# EAGLE design Eliz (EAGLE 9.0.0)
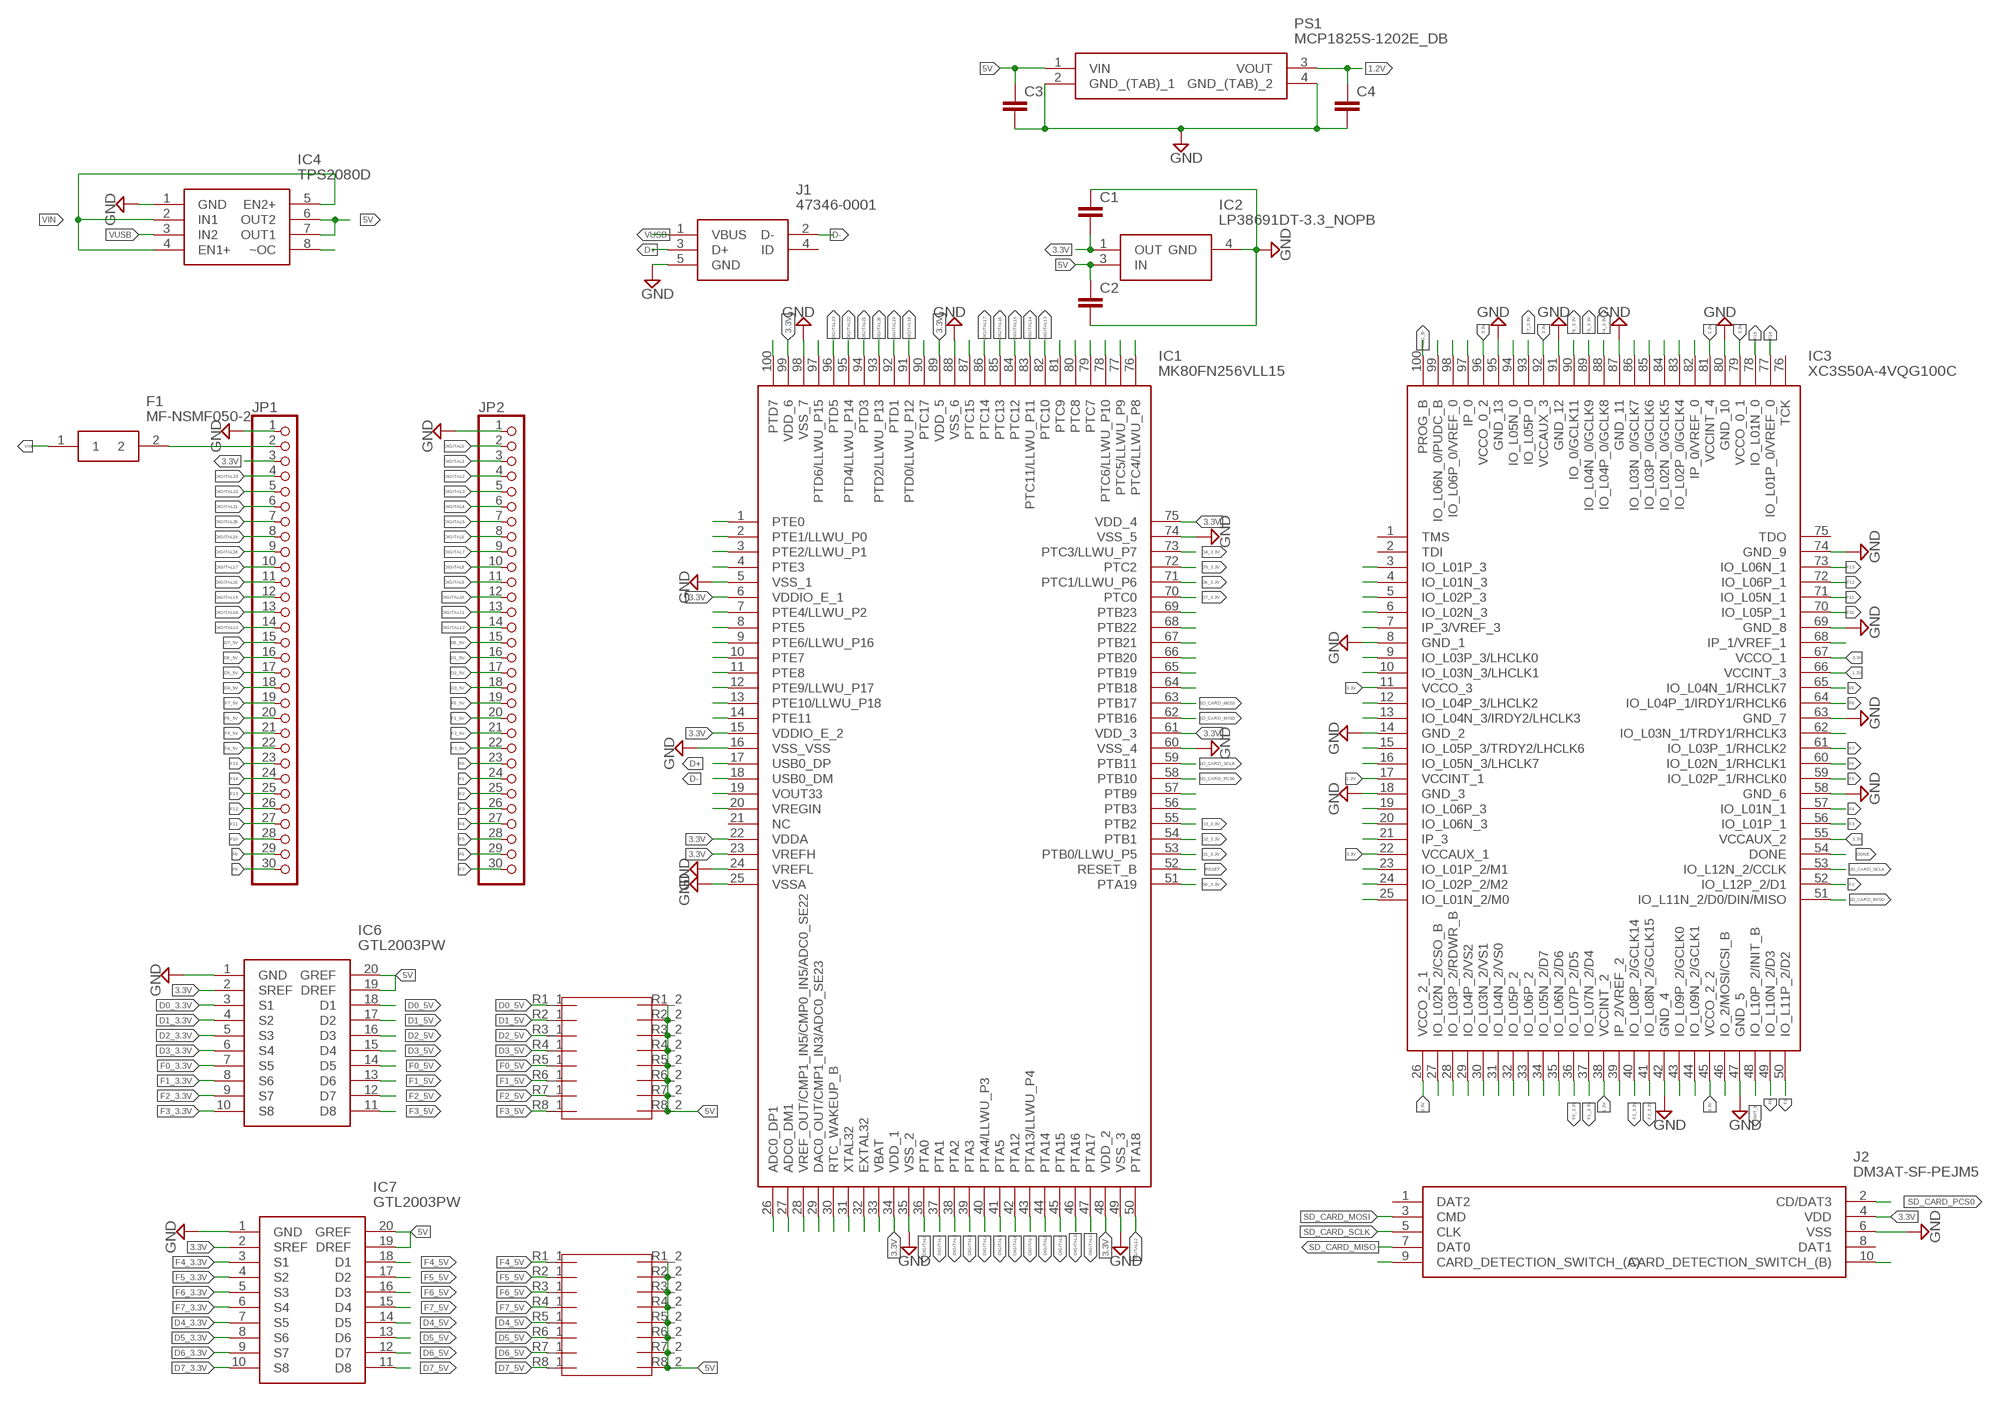
[diagram p0: schematic, sheet 1]

## Parts
C1  C-EUC0805  [C0805]
C2  C-EUC0805  [C0805]
C3  C-EUC0805  [C0805]
C4  C-EUC0805  [C0805]
F1  MF-NSMF050-2  [FUSC3216X85N]
IC1  MK80FN256VLL15  [QFP50P1600X1600X170-100N]
IC2  LP38691DT-3.3_NOPB  [TO228P991X238-3N]
IC3  XC3S50A-4VQG100C  [QFP50P1600X1600X120-100N]
IC4  TPS2080D  [SOIC127P600X175-8N]
IC6  GTL2003PW  [SOP65P640X110-20N]
IC7  GTL2003PW  [SOP65P640X110-20N]
J1  47346-0001  [47346-0001]
J2  DM3AT-SF-PEJM5  [DM3AT-SF-PEJM5_1]
JP1  PINHD-1X30  [1X30]
JP2  PINHD-1X30  [1X30]
PS1  MCP1825S-1202E_DB  [SOT230P700X180-4N]
U$1  EXB2HV472JV  [8*4,7KOHM]
U$2  EXB2HV472JV  [8*4,7KOHM]

## Nets
1.2V: C4.1 IC3.17(VCCINT_1) IC3.38(VCCINT_2) IC3.66(VCCINT_3) IC3.81(VCCINT_4) PS1.3(VOUT)
3.3V: C1.2 IC1.6(VDDIO_E_1) IC1.15(VDDIO_E_2) IC1.22(VDDA) IC1.23(VREFH) IC1.34(VDD_1) IC1.48(VDD_2) IC1.61(VDD_3) IC1.75(VDD_4) IC1.89(VDD_5) IC1.99(VDD_6) IC2.1(OUT) IC3.11(VCCO_3) IC3.22(VCCAUX_1) IC3.26(VCCO_2_1) IC3.45(VCCO_2_2) IC3.55(VCCAUX_2) IC3.67(VCCO_1) IC3.79(VCCO_0_1) IC3.92(VCCAUX_3) IC3.96(VCCO_0_2) IC6.2(SREF) IC7.2(SREF) J2.4(VDD) JP1.3
5V: C2.1 C3.1 IC2.3(IN) IC4.6(OUT2) IC4.7(OUT1) IC6.19(DREF) IC6.20(GREF) IC7.19(DREF) IC7.20(GREF) PS1.1(VIN) U$1.R1_2 U$1.R2_2 U$1.R3_2 U$1.R4_2 U$1.R5_2 U$1.R6_2 U$1.R7_2 U$1.R8_2 U$2.R1_2 U$2.R2_2 U$2.R3_2 U$2.R4_2 U$2.R5_2 U$2.R6_2 U$2.R7_2 U$2.R8_2
D0_3.3V: IC1.51(PTA19) IC6.3(S1)
D0_5V: IC6.18(D1) JP2.15 U$1.R1_1
D1_3.3V: IC1.53(PTB0/LLWU_P5) IC6.4(S2)
D1_5V: IC6.17(D2) JP2.16 U$1.R2_1
D2_3.3V: IC1.54(PTB1) IC6.5(S3)
D2_5V: IC6.16(D3) JP2.17 U$1.R3_1
D3_3.3V: IC1.55(PTB2) IC6.6(S4)
D3_5V: IC6.15(D4) JP2.18 U$1.R4_1
D4_3.3V: IC1.73(PTC3/LLWU_P7) IC7.7(S5)
D4_5V: IC7.14(D5) JP1.18 U$2.R5_1
D5_3.3V: IC1.72(PTC2) IC7.8(S6)
D5_5V: IC7.13(D6) JP1.17 U$2.R6_1
D6_3.3V: IC1.71(PTC1/LLWU_P6) IC7.9(S7)
D6_5V: IC7.12(D7) JP1.16 U$2.R7_1
D7_3.3V: IC1.70(PTC0) IC7.10(S8)
D7_5V: IC7.11(D8) JP1.15 U$2.R8_1
D+: IC1.17(USB0_DP) J1.3(D+)
D-: IC1.18(USB0_DM) J1.2(D-)
DIGITAL0: IC1.36(PTA0) JP2.2
DIGITAL1: IC1.37(PTA1) JP2.3
DIGITAL2: IC1.38(PTA2) JP2.4
DIGITAL3: IC1.39(PTA3) JP2.5
DIGITAL4: IC1.40(PTA4/LLWU_P3) JP2.6
DIGITAL5: IC1.41(PTA5) JP2.7
DIGITAL6: IC1.42(PTA12) JP2.8
DIGITAL7: IC1.43(PTA13/LLWU_P4) JP2.9
DIGITAL8: IC1.44(PTA14) JP2.10
DIGITAL9: IC1.45(PTA15) JP2.11
DIGITAL10: IC1.46(PTA16) JP2.12
DIGITAL11: IC1.47(PTA17) JP2.13
DIGITAL12: IC1.50(PTA18) JP2.14
DIGITAL13: IC1.82(PTC10) JP1.14
DIGITAL14: IC1.83(PTC11/LLWU_P11) JP1.13
DIGITAL15: IC1.84(PTC12) JP1.12
DIGITAL16: IC1.85(PTC13) JP1.11
DIGITAL17: IC1.86(PTC14) JP1.10
DIGITAL18: IC1.91(PTD0/LLWU_P12) JP1.9
DIGITAL19: IC1.92(PTD1) JP1.8
DIGITAL20: IC1.93(PTD2/LLWU_P13) JP1.7
DIGITAL21: IC1.94(PTD3) JP1.6
DIGITAL22: IC1.95(PTD4/LLWU_P14) JP1.5
DIGITAL23: IC1.96(PTD5) JP1.4
DONE: IC3.54(DONE)
F0: IC3.49(IO_L10N_2/D3) JP2.23
F0_3.3V: IC3.36(IO_L07P_2/D5) IC6.7(S5)
F0_5V: IC6.14(D5) JP2.19 U$1.R5_1
F1: IC3.50(IO_L11P_2/D2) JP2.24
F1_3.3V: IC3.37(IO_L07N_2/D4) IC6.8(S6)
F1_5V: IC6.13(D6) JP2.20 U$1.R6_1
F2: IC3.52(IO_L12P_2/D1) JP2.25
F2_3.3V: IC3.40(IO_L08P_2/GCLK14) IC6.9(S7)
F2_5V: IC6.12(D7) JP2.21 U$1.R7_1
F3: IC3.56(IO_L01P_1) JP2.26
F3_3.3V: IC3.41(IO_L08N_2/GCLK15) IC6.10(S8)
F3_5V: IC6.11(D8) JP2.22 U$1.R8_1
F4: IC3.57(IO_L01N_1) JP2.27
F4_3.3V: IC3.88(IO_L04P_0/GCLK8) IC7.3(S1)
F4_5V: IC7.18(D1) JP1.22 U$2.R1_1
F5: IC3.59(IO_L02P_1/RHCLK0) JP2.28
F5_3.3V: IC3.89(IO_L04N_0/GCLK9) IC7.4(S2)
F5_5V: IC7.17(D2) JP1.21 U$2.R2_1
F6: IC3.60(IO_L02N_1/RHCLK1) JP2.29
F6_3.3V: IC3.90(IO_0/GCLK11) IC7.5(S3)
F6_5V: IC7.16(D3) JP1.20 U$2.R3_1
F7: IC3.61(IO_L03P_1/RHCLK2) JP2.30
F7_3.3V: IC3.93(IO_L05P_0) IC7.6(S4)
F7_5V: IC7.15(D4) JP1.19 U$2.R4_1
F8: IC3.64(IO_L04P_1/IRDY1/RHCLK6) JP1.30
F9: IC3.65(IO_L04N_1/RHCLK7) JP1.29
F10: IC3.70(IO_L05P_1) JP1.28
F11: IC3.71(IO_L05N_1) JP1.27
F12: IC3.72(IO_L06P_1) JP1.26
F13: IC3.73(IO_L06N_1) JP1.25
F14: IC3.77(IO_L01P_0/VREF_0) JP1.24
F15: IC3.78(IO_L01N_0) JP1.23
GND: C1.1 C2.2 C3.2 C4.2 IC1.5(VSS_1) IC1.16(VSS_VSS) IC1.24(VREFL) IC1.25(VSSA) IC1.35(VSS_2) IC1.49(VSS_3) IC1.60(VSS_4) IC1.74(VSS_5) IC1.88(VSS_6) IC1.98(VSS_7) IC2.4(GND) IC3.8(GND_1) IC3.14(GND_2) IC3.18(GND_3) IC3.42(GND_4) IC3.47(GND_5) IC3.58(GND_6) IC3.63(GND_7) IC3.69(GND_8) IC3.74(GND_9) IC3.80(GND_10) IC3.87(GND_11) IC3.91(GND_12) IC3.95(GND_13) IC4.1(GND) IC6.1(GND) IC7.1(GND) J1.5(GND) J2.6(VSS) JP1.1 JP2.1 PS1.2(GND_(TAB)_1) PS1.4(GND_(TAB)_2)
INIT_B: IC3.48(IO_L10P_2/INIT_B)
N$1: IC1.1(PTE0)
N$2: IC1.2(PTE1/LLWU_P0)
N$3: IC1.3(PTE2/LLWU_P1)
N$4: IC1.4(PTE3)
N$5: IC1.7(PTE4/LLWU_P2)
N$6: IC1.8(PTE5)
N$7: IC1.9(PTE6/LLWU_P16)
N$8: IC1.10(PTE7)
N$9: IC1.11(PTE8)
N$10: IC1.12(PTE9/LLWU_P17)
N$11: IC1.13(PTE10/LLWU_P18)
N$12: IC1.14(PTE11)
N$14: IC1.87(PTC15)
N$15: IC1.19(VOUT33)
N$16: IC1.20(VREGIN)
N$17: IC1.56(PTB3)
N$18: IC1.26(ADC0_DP1)
N$19: IC1.27(ADC0_DM1)
N$20: IC1.28(VREF_OUT/CMP1_IN5/CMP0_IN5/ADC0_SE22)
N$21: IC1.29(DAC0_OUT/CMP1_IN3/ADC0_SE23)
N$22: IC1.30(RTC_WAKEUP_B)
N$23: IC1.31(XTAL32)
N$24: IC1.32(EXTAL32)
N$25: IC1.33(VBAT)
N$26: IC1.69(PTB23)
N$29: IC3.3(IO_L01P_3)
N$30: F1.2 JP1.2
N$32: IC3.4(IO_L01N_3)
N$33: IC3.5(IO_L02P_3)
N$34: IC3.6(IO_L02N_3)
N$35: IC3.7(IP_3/VREF_3)
N$37: IC3.9(IO_L03P_3/LHCLK0)
N$38: IC3.10(IO_L03N_3/LHCLK1)
N$40: IC3.12(IO_L04P_3/LHCLK2)
N$41: IC3.13(IO_L04N_3/IRDY2/LHCLK3)
N$43: IC3.15(IO_L05P_3/TRDY2/LHCLK6)
N$44: IC3.16(IO_L05N_3/LHCLK7)
N$45: IC1.57(PTB9)
N$46: IC1.90(PTC17)
N$48: IC3.19(IO_L06P_3)
N$49: IC3.20(IO_L06N_3)
N$50: IC1.64(PTB18)
N$51: IC1.65(PTB19)
N$52: IC1.66(PTB20)
N$53: IC1.68(PTB22)
N$54: IC1.67(PTB21)
N$60: IC1.76(PTC4/LLWU_P8)
N$61: IC1.77(PTC5/LLWU_P9)
N$62: IC1.78(PTC6/LLWU_P10)
N$63: IC1.79(PTC7)
N$64: IC1.80(PTC8)
N$65: IC1.81(PTC9)
N$79: IC1.97(PTD6/LLWU_P15)
N$80: IC1.100(PTD7)
N$81: IC3.21(IP_3)
N$83: IC3.23(IO_L01P_2/M1)
N$84: IC3.24(IO_L02P_2/M2)
N$85: IC3.25(IO_L01N_2/M0)
N$87: IC3.27(IO_L02N_2/CSO_B)
N$88: IC3.28(IO_L03P_2/RDWR_B)
N$89: IC3.29(IO_L04P_2/VS2)
N$90: IC3.30(IO_L03N_2/VS1)
N$91: IC3.31(IO_L04N_2/VS0)
N$92: IC3.32(IO_L05P_2)
N$95: IC4.8(~OC)
N$135: IC3.33(IO_L06P_2)
N$136: IC3.34(IO_L05N_2/D7)
N$137: IC3.35(IO_L06N_2/D6)
N$141: IC3.39(IP_2/VREF_2)
N$145: IC3.43(IO_L09P_2/GCLK0)
N$146: IC3.44(IO_L09N_2/GCLK1)
N$148: IC3.46(IO_2/MOSI/CSI_B)
N$164: IC3.62(IO_L03N_1/TRDY1/RHCLK3)
N$170: IC3.68(IP_1/VREF_1)
N$177: J2.9(CARD_DETECTION_SWITCH_(A))
N$184: IC3.82(IP_0/VREF_0)
N$185: IC3.83(IO_L02P_0/GCLK4)
N$186: IC3.84(IO_L02N_0/GCLK5)
N$187: IC3.85(IO_L03P_0/GCLK6)
N$188: IC3.86(IO_L03N_0/GCLK7)
N$196: IC3.94(IO_L05N_0)
N$199: IC3.97(IP_0)
N$200: IC3.98(IO_L06P_0/VREF_0)
N$201: IC3.99(IO_L06N_0/PUDC_B)
N$207: J2.10(CARD_DETECTION_SWITCH_(B))
PROG_B: IC3.100(PROG_B)
RESET: IC1.52(RESET_B)
SD_CARD_MISO: IC1.62(PTB16) IC3.51(IO_L11N_2/D0/DIN/MISO) J2.7(DAT0)
SD_CARD_MOSI: IC1.63(PTB17) J2.3(CMD)
SD_CARD_PCS0: IC1.58(PTB10) J2.2(CD/DAT3)
SD_CARD_SCLK: IC1.59(PTB11) IC3.53(IO_L12N_2/CCLK) J2.5(CLK)
VIN: F1.1 IC4.2(IN1) IC4.4(EN1+) IC4.5(EN2+)
VUSB: IC4.3(IN2) J1.1(VBUS)
Unconnected: IC1.21(NC) IC3.1(TMS) IC3.2(TDI) IC3.75(TDO) IC3.76(TCK) J1.4(ID) J2.1(DAT2) J2.8(DAT1)

## Library data of the parts
C1-C4 = resistor:C-EU: CAPACITOR, European symbol
F1 = INTech:MF-NSMF050-2: Bourns 0.5A Surface Mount Resettable Fuse, 13.2V Source: Datasheet <https://componentsearchengine.com/Datasheets/2/MF-NSMF050-2.pdf>; ALLIED_NUMBER: 70153459; ALLIED_PRICE/STOCK: https://www.alliedelec.com/bourns-mf-nsmf050-2/70153459/; ARROW_PART_NUMBER: MF-NSMF050-2; ARROW_PRICE/STOCK: https://www.arrow.com/en/products/mf-nsmf050-2/bourns; DESCRIPTION: Bourns 0.5A Surface Mount Resettable Fuse, 13.2V; HEIGHT: 0.85mm; MANUFACTURER_NAME: Bourns; MANUFACTURER_PART_NUMBER: MF-NSMF050-2; RS_PART_NUMBER: 6478320P; RS_PRICE/STOCK: http://uk.rs-online.com/web/p/products/6478320P
IC1 = INTech:MK80FN256VLL15: ARM Microcontrollers - MCU MK80FN256VLL15/LQFP100///STANDARD MARKING * TRAY D Source: Datasheet <https://www.nxp.com/docs/en/data-sheet/K80P121M150SF5.pdf>; ARROW_PART_NUMBER: MK80FN256VLL15; ARROW_PRICE/STOCK: https://www.arrow.com/en/products/mk80fn256vll15/nxp-semiconductors; DESCRIPTION: ARM Microcontrollers - MCU MK80FN256VLL15/LQFP100///STANDARD MARKING * TRAY D; HEIGHT: 1.7mm; MANUFACTURER_NAME: Nexperia; MANUFACTURER_PART_NUMBER: MK80FN256VLL15
IC2 = INTech:LP38691DT-3.3_NOPB: 500mA Low Dropout CMOS Linear Regulators Stable with Ceramic Output Capacitors Source: Datasheet <http://www.ti.com/lit/ds/symlink/lp38691.pdf>; ARROW_PART_NUMBER: LP38691DT-3.3/NOPB; ARROW_PRICE/STOCK: https://www.arrow.com/en/products/lp38691dt-3.3nopb/texas-instruments; DESCRIPTION: 500mA Low Dropout CMOS Linear Regulators Stable with Ceramic Output Capacitors; HEIGHT: 2.38mm; MANUFACTURER_NAME: Texas Instruments; MANUFACTURER_PART_NUMBER: LP38691DT-3.3/NOPB; RS_PART_NUMBER: 5378730P; RS_PRICE/STOCK: http://uk.rs-online.com/web/p/products/5378730P
IC3 = INTech:XC3S50A-4VQG100C: Spartan-3A FPGA 50k gates VQFP100 XC3S50A-4VQG100C, FPGA Spartan-3A 1584 Cells, 50000 Gates, 11264bit, 1584 Blocks, 1.14 1.26 V 100-Pin VTQFP Source: Datasheet <http://www.xilinx.com/support/documentation/data_sheets/ds529.pdf>; ARROW_PART_NUMBER: XC3S50A-4VQG100C; ARROW_PRICE/STOCK: http://uk.rs-online.com/web/p/products/1732062; DESCRIPTION: Spartan-3A FPGA 50k gates VQFP100 XC3S50A-4VQG100C, FPGA Spartan-3A 1584 Cells, 50000 Gates, 11264bit, 1584 Blocks, 1.14 1.26 V 100-Pin VTQFP; HEIGHT: 1.2mm; MANUFACTURER_NAME: XILINX; MANUFACTURER_PART_NUMBER: XC3S50A-4VQG100C; RS_PART_NUMBER: 1732062; RS_PRICE/STOCK: http://uk.rs-online.com/web/p/products/1732062
IC4 = INTech:TPS2080D: 0.7A 2.7 to 5.5V Dual (2 In/2 Out) High-Side MOSFET Switch IC Fault Reporting 2 Act-High Enable Source: Datasheet <http://www.ti.com/lit/gpn/tps2080>; ARROW_PART_NUMBER: TPS2080D; ARROW_PRICE/STOCK: https://www.arrow.com/en/products/tps2080d/texas-instruments; DESCRIPTION: 0.7A 2.7 to 5.5V Dual (2 In/2 Out) High-Side MOSFET Switch IC Fault Reporting 2 Act-High Enable; HEIGHT: mm; MANUFACTURER_NAME: Texas Instruments; MANUFACTURER_PART_NUMBER: TPS2080D; RS_PART_NUMBER: 6608007P; RS_PRICE/STOCK: http://uk.rs-online.com/web/p/products/6608007P
IC6 IC7 = INTech:GTL2003PW: NXP - GTL2003PW - IC, GTL LO-VOLT TRANSLATOR, 20TSSOP Source: Datasheet <http://www.nxp.com/documents/data_sheet/GTL2003.pdf>; ARROW_PART_NUMBER: GTL2003PW; DESCRIPTION: NXP - GTL2003PW - IC, GTL LO-VOLT TRANSLATOR, 20TSSOP; HEIGHT: 1.1mm; MANUFACTURER_NAME: Nexperia; MANUFACTURER_PART_NUMBER: GTL2003PW; RS_PART_NUMBER: 510960
J1 = INTech:47346-0001: Micro USB B Receptacle Bottom Mount Assy Molex Right Angle SMT Type B Version 2.0 Micro USB Connector Socket, 30 V ac, 1A 47352 MICRO-USB Source: Datasheet <http://www.molex.com/pdm_docs/sd/473460001_sd.pdf>; ALLIED_NUMBER: 70266948; ALLIED_PRICE/STOCK: https://www.alliedelec.com/molex-incorporated-47346-0001/70266948/; ARROW_PART_NUMBER: 47346-0001; ARROW_PRICE/STOCK: http://uk.rs-online.com/web/p/products/7025475P; DESCRIPTION: Micro USB B Receptacle Bottom Mount Assy Molex Right Angle SMT Type B Version 2.0 Micro USB Connector Socket, 30 V ac, 1A 47352 MICRO-USB; HEIGHT: mm; MANUFACTURER_NAME: Molex; MANUFACTURER_PART_NUMBER: 47346-0001; RS_PART_NUMBER: 7025475P; RS_PRICE/STOCK: http://uk.rs-online.com/web/p/products/7025475P
J2 = INTech:DM3AT-SF-PEJM5: DM3 RA SMT microSD memory card push/push DM3 RA SMT microSD memory card push/push Source: Datasheet <https://www.hirose.com/product/en/download_file/key_name/DM3AT-SF-PEJM5/category/Drawing (2D)/doc_file_id/44099/?file_category_id=6&item_id=06090031000&is_series=>; ARROW_PART_NUMBER: DM3AT-SF-PEJM5; ARROW_PRICE/STOCK: https://www.arrow.com/en/products/dm3at-sf-pejm5/hirose-electric; DESCRIPTION: DM3 RA SMT microSD memory card push/push DM3 RA SMT microSD memory card push/push; HEIGHT: mm; MANUFACTURER_NAME: Hirose; MANUFACTURER_PART_NUMBER: DM3AT-SF-PEJM5; RS_PART_NUMBER: 1722520; RS_PRICE/STOCK: http://uk.rs-online.com/web/p/products/1722520
JP1 JP2 = pinhead:PINHD-1X30: PIN HEADER
PS1 = INTech:MCP1825S-1202E_DB: LDO Low Iq 500mA 1.2V 2.5% SOT223 MCP1825S-1202E/DB, Low Dropout Voltage Regulator, 500mA, 1.2 V 2.5%, 2.1 6 Vin, 3-Pin SOT-223 Source: Datasheet <https://componentsearchengine.com/Datasheets/2/MCP1825S-1202E_DB.pdf>; ALLIED_NUMBER: 70414964; ALLIED_PRICE/STOCK: https://www.alliedelec.com/microchip-technology-inc-mcp1825s-1202e-db/70414964/; ARROW_PART_NUMBER: MCP1825S-1202E/DB; ARROW_PRICE/STOCK: https://www.arrow.com/en/products/mcp1825s-1202edb/microchip-technology; DESCRIPTION: LDO Low Iq 500mA 1.2V 2.5% SOT223 MCP1825S-1202E/DB, Low Dropout Voltage Regulator, 500mA, 1.2 V 2.5%, 2.1 6 Vin, 3-Pin SOT-223; HEIGHT: 1.8mm; MANUFACTURER_NAME: Microchip; MANUFACTURER_PART_NUMBER: MCP1825S-1202E/DB; RS_PART_NUMBER: 1651983; RS_PRICE/STOCK: http://uk.rs-online.com/web/p/products/1651983
U$1 U$2 = INTech:EXB2HV472JV; FARNELL: 2060080; MF: Panasonic

## Board
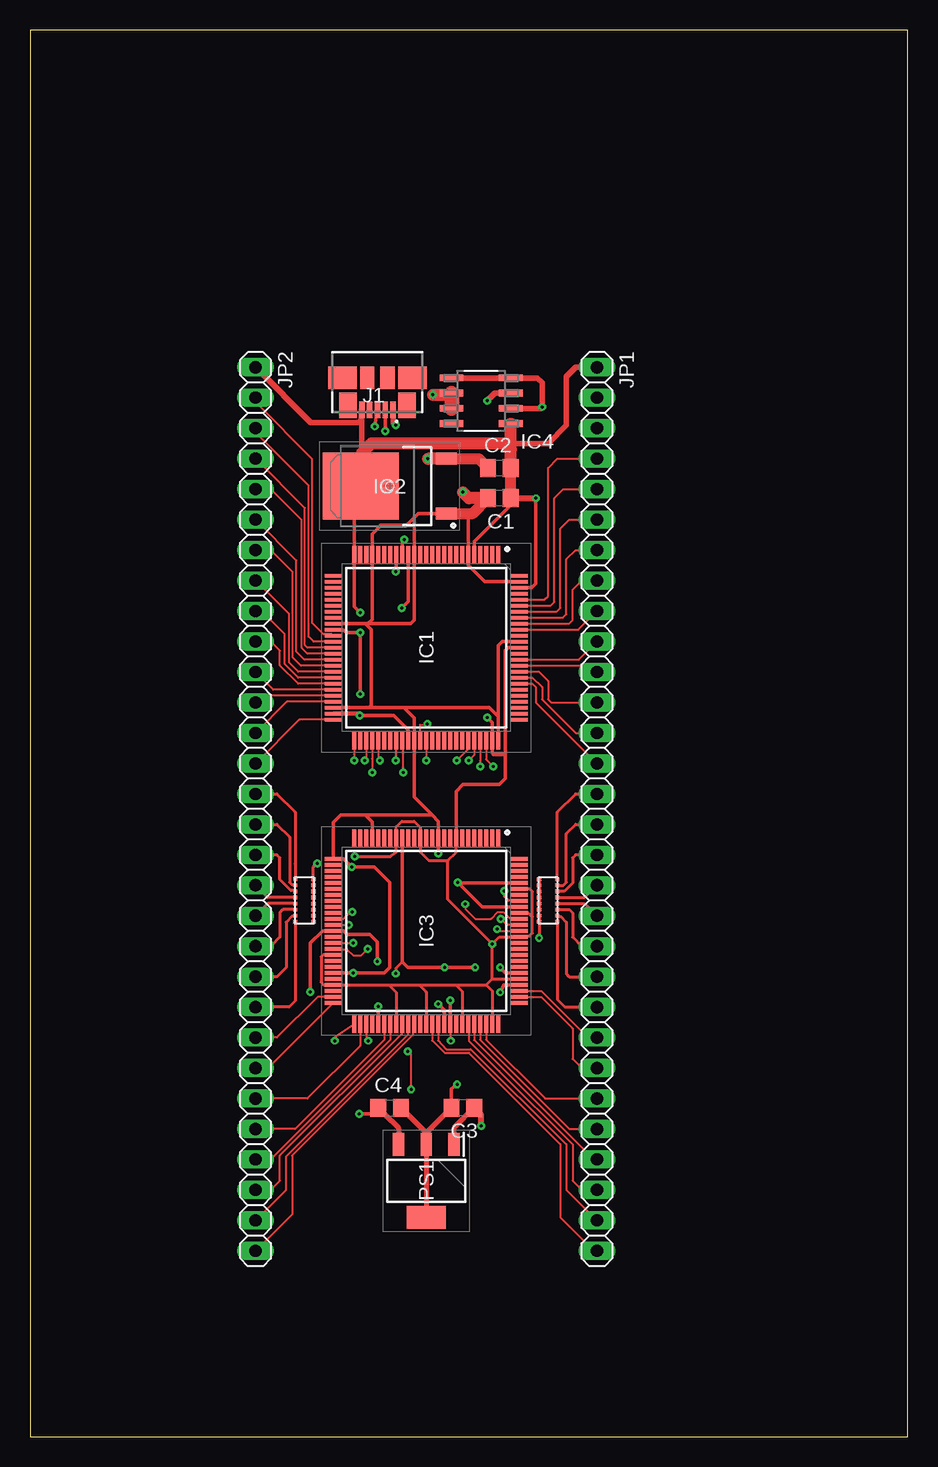
[diagram p1: board, top side]
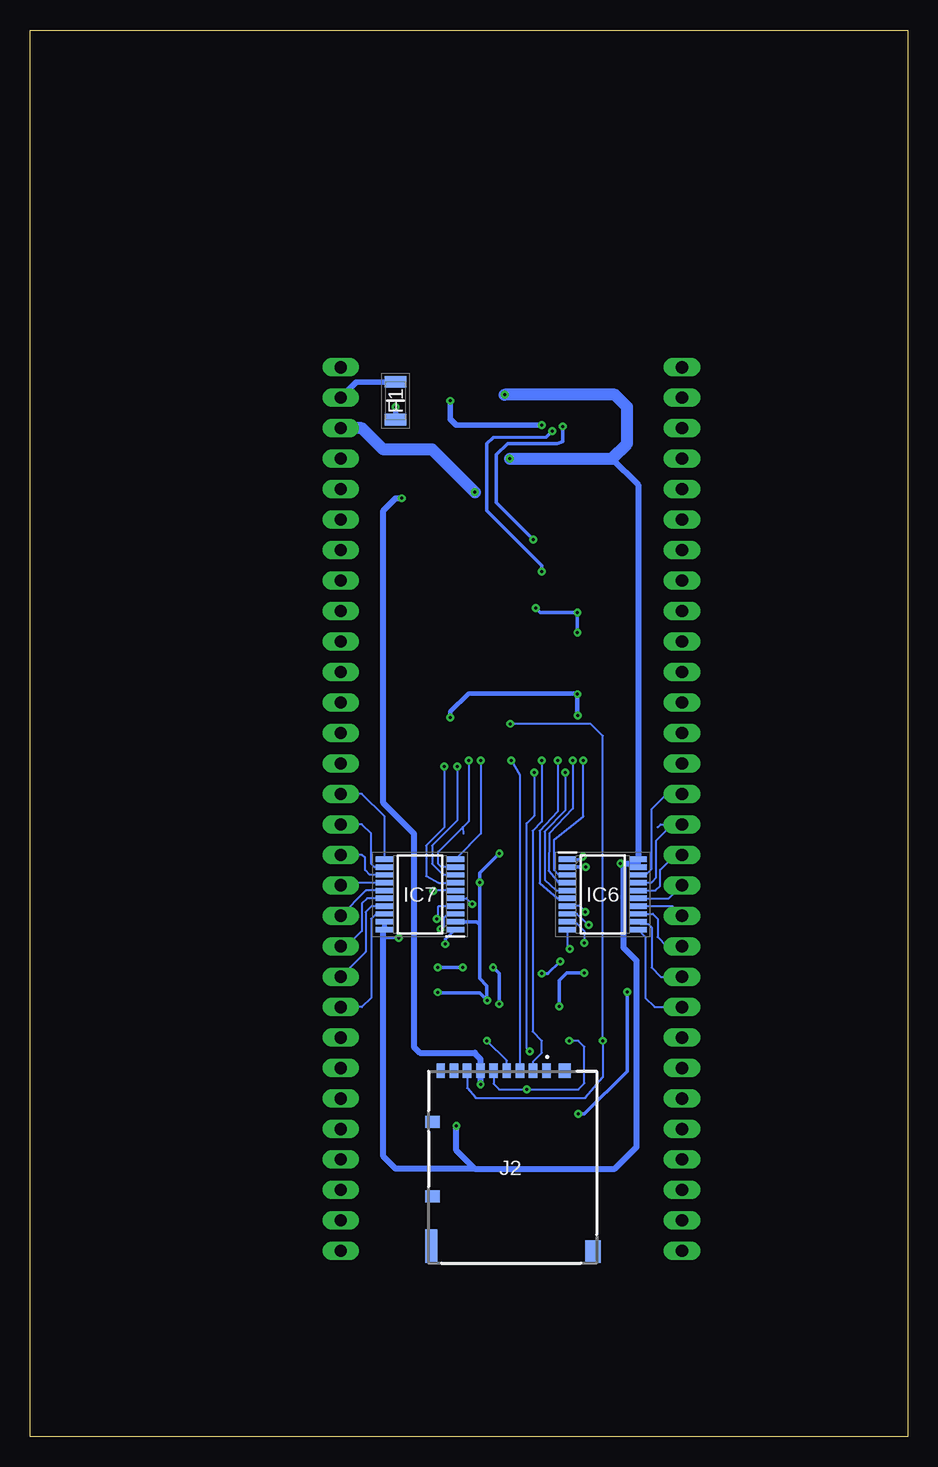
[diagram p2: board, bottom side, seen from below]

Size 73.13 x 117.27 mm. Coordinates in mm from the lower left corner, seen from the top.
Outline: 0,0 73.13,0 73.13,117.27 0,117.27 0,0
Copper layers (1*16): Top 0.035mm / dielectric 1.5mm / Bottom 0.035mm
Design rules "default *": minimum track width 6mil, minimum drill 0.25mm, track to track 6mil, track to pad 6mil, pad to pad 6mil, via to via 6mil, smd to smd 6mil, copper to edge 40mil, drill to drill 6mil, minimum pad ring 10mil, minimum via ring 8mil, stop-mask expansion 4mil, vias tented up to drill 0mil, thermal gap 10mil

### Footprints (pad centres in the part's own frame; a part is rotated, then mirrored left to right if it is on the bottom)
C0805 = smd 1.3 x 1.5: 1 -0.95,0; 2 0.95,0
FUSC3216X85N = smd 0.97 x 1.82: 1 -1.57,0; 2 1.57,0
QFP50P1600X1600X170-100N = smd 1.475 x 0.3: 1 -7.738,6; 2 -7.738,5.5; 3 -7.738,5; 4 -7.738,4.5; 5 -7.738,4; 6 -7.738,3.5; 7 -7.738,3; 8 -7.738,2.5; 9 -7.738,2; 10 -7.738,1.5; 11 -7.738,1; 12 -7.738,0.5; 13 -7.738,0; 14 -7.738,-0.5; 15 -7.738,-1; 16 -7.738,-1.5; 17 -7.738,-2; 18 -7.738,-2.5; 19 -7.738,-3; 20 -7.738,-3.5; 21 -7.738,-4; 22 -7.738,-4.5; 23 -7.738,-5; 24 -7.738,-5.5; 25 -7.738,-6; 51 7.738,-6; 52 7.738,-5.5; 53 7.738,-5; 54 7.738,-4.5; 55 7.738,-4; 56 7.738,-3.5; 57 7.738,-3; 58 7.738,-2.5; 59 7.738,-2; 60 7.738,-1.5; 61 7.738,-1; 62 7.738,-0.5; 63 7.738,0; 64 7.738,0.5; 65 7.738,1; 66 7.738,1.5; 67 7.738,2; 68 7.738,2.5; 69 7.738,3; 70 7.738,3.5; 71 7.738,4; 72 7.738,4.5; 73 7.738,5; 74 7.738,5.5; 75 7.738,6 | smd 0.3 x 1.475: 26 -6,-7.738; 27 -5.5,-7.738; 28 -5,-7.738; 29 -4.5,-7.738; 30 -4,-7.738; 31 -3.5,-7.738; 32 -3,-7.738; 33 -2.5,-7.738; 34 -2,-7.738; 35 -1.5,-7.738; 36 -1,-7.738; 37 -0.5,-7.738; 38 0,-7.738; 39 0.5,-7.738; 40 1,-7.738; 41 1.5,-7.738; 42 2,-7.738; 43 2.5,-7.738; 44 3,-7.738; 45 3.5,-7.738; 46 4,-7.738; 47 4.5,-7.738; 48 5,-7.738; 49 5.5,-7.738; 50 6,-7.738; 76 6,7.738; 77 5.5,7.738; 78 5,7.738; 79 4.5,7.738; 80 4,7.738; 81 3.5,7.738; 82 3,7.738; 83 2.5,7.738; 84 2,7.738; 85 1.5,7.738; 86 1,7.738; 87 0.5,7.738; 88 0,7.738; 89 -0.5,7.738; 90 -1,7.738; 91 -1.5,7.738; 92 -2,7.738; 93 -2.5,7.738; 94 -3,7.738; 95 -3.5,7.738; 96 -4,7.738; 97 -4.5,7.738; 98 -5,7.738; 99 -5.5,7.738; 100 -6,7.738
TO228P991X238-3N = smd 1.75 x 1: 1 -4.7,2.285; 3 -4.7,-2.285 | smd 6.35 x 5.55: 4 2.4,0
QFP50P1600X1600X120-100N = smd 1.475 x 0.3: 1 -7.738,6; 2 -7.738,5.5; 3 -7.738,5; 4 -7.738,4.5; 5 -7.738,4; 6 -7.738,3.5; 7 -7.738,3; 8 -7.738,2.5; 9 -7.738,2; 10 -7.738,1.5; 11 -7.738,1; 12 -7.738,0.5; 13 -7.738,0; 14 -7.738,-0.5; 15 -7.738,-1; 16 -7.738,-1.5; 17 -7.738,-2; 18 -7.738,-2.5; 19 -7.738,-3; 20 -7.738,-3.5; 21 -7.738,-4; 22 -7.738,-4.5; 23 -7.738,-5; 24 -7.738,-5.5; 25 -7.738,-6; 51 7.738,-6; 52 7.738,-5.5; 53 7.738,-5; 54 7.738,-4.5; 55 7.738,-4; 56 7.738,-3.5; 57 7.738,-3; 58 7.738,-2.5; 59 7.738,-2; 60 7.738,-1.5; 61 7.738,-1; 62 7.738,-0.5; 63 7.738,0; 64 7.738,0.5; 65 7.738,1; 66 7.738,1.5; 67 7.738,2; 68 7.738,2.5; 69 7.738,3; 70 7.738,3.5; 71 7.738,4; 72 7.738,4.5; 73 7.738,5; 74 7.738,5.5; 75 7.738,6 | smd 0.3 x 1.475: 26 -6,-7.738; 27 -5.5,-7.738; 28 -5,-7.738; 29 -4.5,-7.738; 30 -4,-7.738; 31 -3.5,-7.738; 32 -3,-7.738; 33 -2.5,-7.738; 34 -2,-7.738; 35 -1.5,-7.738; 36 -1,-7.738; 37 -0.5,-7.738; 38 0,-7.738; 39 0.5,-7.738; 40 1,-7.738; 41 1.5,-7.738; 42 2,-7.738; 43 2.5,-7.738; 44 3,-7.738; 45 3.5,-7.738; 46 4,-7.738; 47 4.5,-7.738; 48 5,-7.738; 49 5.5,-7.738; 50 6,-7.738; 76 6,7.738; 77 5.5,7.738; 78 5,7.738; 79 4.5,7.738; 80 4,7.738; 81 3.5,7.738; 82 3,7.738; 83 2.5,7.738; 84 2,7.738; 85 1.5,7.738; 86 1,7.738; 87 0.5,7.738; 88 0,7.738; 89 -0.5,7.738; 90 -1,7.738; 91 -1.5,7.738; 92 -2,7.738; 93 -2.5,7.738; 94 -3,7.738; 95 -3.5,7.738; 96 -4,7.738; 97 -4.5,7.738; 98 -5,7.738; 99 -5.5,7.738; 100 -6,7.738
SOIC127P600X175-8N = smd 1.981 x 0.559: 1 -2.464,1.905; 2 -2.464,0.635; 3 -2.464,-0.635; 4 -2.464,-1.905; 5 2.464,-1.905; 6 2.464,-0.635; 7 2.464,0.635; 8 2.464,1.905
SOP65P640X110-20N = smd 1.475 x 0.45: 1 -2.938,2.925; 2 -2.938,2.275; 3 -2.938,1.625; 4 -2.938,0.975; 5 -2.938,0.325; 6 -2.938,-0.325; 7 -2.938,-0.975; 8 -2.938,-1.625; 9 -2.938,-2.275; 10 -2.938,-2.925; 11 2.938,-2.925; 12 2.938,-2.275; 13 2.938,-1.625; 14 2.938,-0.975; 15 2.938,-0.325; 16 2.938,0.325; 17 2.938,0.975; 18 2.938,1.625; 19 2.938,2.275; 20 2.938,2.925
47346-0001 = smd 0.45 x 1.38: 1 1.3,-4.81; 2 0.65,-4.81; 3 0,-4.81; 4 -0.65,-4.81; 5 -1.3,-4.81 | smd 1.475 x 2.1: 6 -2.453,-4.45; 7 2.453,-4.45 | smd 1.175 x 1.9: 8 0.838,-2.15; 9 -0.838,-2.15 | smd 2.375 x 1.9: 10 2.913,-2.15; 11 -2.913,-2.15
DM3AT-SF-PEJM5_1 = smd 0.7 x 1.2: 1 -4.191,0.057; 2 -5.291,0.057; 3 -6.391,0.057; 4 -7.491,0.057; 5 -8.591,0.057; 6 -9.691,0.057; 7 -10.791,0.057; 8 -11.891,0.057; 10 -12.991,0.057 | smd 1.2 x 1: 9 -13.691,-10.443; 12 -13.691,-4.243 | smd 1 x 1.2: 11 -2.641,0.057 | smd 1 x 2.8: 13 -13.791,-14.593 | smd 1.3 x 1.9: 14 -0.291,-15.043
1X30 = drill 1.016 long: 1 -36.83,0; 2 -34.29,0; 3 -31.75,0; 4 -29.21,0; 5 -26.67,0; 6 -24.13,0; 7 -21.59,0; 8 -19.05,0; 9 -16.51,0; 10 -13.97,0; 11 -11.43,0; 12 -8.89,0; 13 -6.35,0; 14 -3.81,0; 15 -1.27,0; 16 1.27,0; 17 3.81,0; 18 6.35,0; 19 8.89,0; 20 11.43,0; 21 13.97,0; 22 16.51,0; 23 19.05,0; 24 21.59,0; 25 24.13,0; 26 26.67,0; 27 29.21,0; 28 31.75,0; 29 34.29,0; 30 36.83,0
SOT230P700X180-4N = smd 1.9 x 0.95: 1 -3.05,2.3; 2 -3.05,0; 3 -3.05,-2.3 | smd 1.9 x 3.25: 4 3.05,0
8*4,7KOHM = smd 0.356 x 0.305: R1_1 -0.762,1.778; R1_2 0.762,1.778; R2_1 -0.762,1.27; R2_2 0.762,1.27; R3_1 -0.762,0.762; R3_2 0.762,0.762; R4_1 -0.762,0.254; R4_2 0.762,0.254; R5_1 -0.762,-0.254; R5_2 0.762,-0.254; R6_1 -0.762,-0.762; R6_2 0.762,-0.762; R7_1 -0.762,-1.27; R7_2 0.762,-1.27; R8_1 -0.762,-1.778; R8_2 0.762,-1.778

### Placement (x,y rotation side)
C1  39.12,78.23 180 top
C2  39.12,80.77 0 top
C3  36.07,27.43 180 top
C4  29.97,27.43 0 top
F1  42.67,86.36 90 bottom
IC1  33.02,65.79 270 top
IC2  29.97,79.25 180 top
IC3  33.02,42.16 270 top
IC4  37.59,86.36 180 top
IC6  25.4,45.21 0 bottom
IC7  40.64,45.21 180 bottom
J1  28.96,90.42 0 top
J2  25.91,30.48 0 bottom
JP1  47.24,52.32 270 top
JP2  18.8,52.32 270 top
PS1  33.02,21.34 270 top
U$1  22.86,44.7 0 top
U$2  43.18,44.7 180 top

### Tracks (layer width: path | path; a pad name or v marks a point on that pad's centre or on a via)
1.2V  (via drill 0.25 pad 0.55)
  Top 0.254: 31.02,39.59 30.48,39.05 v30.48,38.61
  Top 0.305: v23.37,37.08 23.37,41.15 24.38,42.16 IC3.38 26.14,42.16 26.42,41.88 28.32,41.88 28.96,41.25 v28.96,39.62 | v27.43,26.92 28.96,26.92 29.24,27.21 | IC3.81 39.62,38.66 v39.17,39.12 | v37.08,39.12 v34.54,39.12 31.5,39.12 31.02,39.59 IC3.17 | IC3.66 34.52,35.58 v34.04,36.07
  Top 0.406: PS1.3 30.72,25.73 30.13,26.33 30.12,26.33 29.92,26.54 29.24,27.21 C4.1
  Bottom 0.254: v30.48,38.61 29.97,38.61 v28.96,39.62
  Bottom 0.305: v23.37,37.08 23.37,30.48 26.92,26.92 v27.43,26.92 | v39.17,39.12 v37.08,39.12 | v34.54,39.12 34.04,38.61 v34.04,36.07
3.3V  (via drill 0.25 pad 0.55)
  Top 0.152: v35.05,33.02 35.05,34.41 IC3.67
  Top 0.305: 32.02,76.62 IC1.15 32.02,68.09 31.72,67.79 28.16,67.79 | 36.52,76.59 IC1.6 36.52,72.67 37.9,71.29 IC1.99 | IC1.34 27.94,67.79 | 27.94,67.79 28.16,67.79 | 28.16,67.79 28.52,68.14 IC1.22 28.52,75.26 29.21,75.95 | IC1.48 28.27,60.79 | 28.27,60.79 28.45,60.96 28.45,67.28 27.94,67.79 | 28.27,60.79 31.16,60.79 | 31.16,60.79 32.02,59.93 IC1.61 32.02,53.32 33.53,51.82 | 31.16,60.79 38.27,60.79 39.02,60.04 | 39.02,60.04 IC1.75 | 39.02,60.04 39.02,65.94 39.36,66.29 IC1.89 | 31.34,75.95 32.02,76.62 | 32.02,76.62 32.02,76.69 | 32.02,76.62 32.36,76.96 IC2.1 | IC3.22 28.52,51.24 27.94,51.82 | 27.94,51.82 25.91,51.82 25.28,51.19 IC3.26 26.16,48.16 v26.82,47.5 28.7,47.5 29.97,46.23 29.97,39.12 29.52,38.66 v26.95,38.66 v26.94,38.66 | IC3.45 v26.94,38.66 | v29.03,35.87 29.03,34.44 IC3.55 | v35.03,36.37 IC3.67 | v39.17,37.06 39.47,37.66 IC3.79 | 26.98,38.66 v26.94,38.66 | v34.01,48.64 IC3.11 34.04,49.92 34.04,51.31 33.53,51.82 | 27.94,51.82 33.53,51.82 | IC3.96 35.69,46.16 | 35.69,46.16 v35.65,46.2 | 35.69,46.16 37.69,44.16 IC3.92
  Top 0.356: 36.52,76.59 36.9,76.96 | 29.21,75.95 31.34,75.95
  Top 0.914: IC2.1 36.9,76.96 C1.2
  Top 1.016: C1.2 36.58,78.23 v36.07,78.74
  Bottom 0.152: J2.4 33.4,31.37 v35.05,33.02
  Bottom 0.305: v26.95,38.66 28.4,38.66 29.03,38.02 v29.03,35.87 | v26.82,47.5 28.33,47.5 IC6.2 | v39.17,37.06 39.1,36.99 35.65,36.99 v35.03,36.37 35.05,36.4 35.05,37.59 35.65,38.19 35.65,42.67 | v34.01,48.64 35.65,47 v35.65,46.2 35.65,42.67 | IC7.2 35.91,42.94 35.65,42.67
  Bottom 1.016: v36.07,78.74 39.62,82.3 43.69,82.3 45.47,84.07 JP1.3
  pour Top (no thermals): 27.86,74.27 27.86,72.77 28.68,72.77 28.68,74.27
5V  (via drill 0.25 pad 0.55)
  Top 0.254: U$1.R8_2 U$1.R7_2 U$1.R6_2 U$1.R5_2 U$1.R4_2 U$1.R3_2 U$1.R2_2 U$1.R1_2 23.62,47.5 v23.93,47.8 | U$2.R8_2 U$2.R7_2 U$2.R6_2 U$2.R5_2 U$2.R4_2 U$2.R3_2 U$2.R2_2 U$2.R1_2 v42.42,41.58
  Top 0.406: PS1.1 35.32,25.73 35.91,26.33 36.12,26.54 C3.1
  Top 0.508: v37.59,25.91 37.59,26.86 C3.1
  Top 0.914: IC2.3 37.41,81.53 C2.1
  Top 1.016: IC2.3 v33.15,81.53 | v33.58,86.87 35,86.87 IC4.6
  Top 1.27: IC4.6 IC4.7
  Bottom 0.254: 22.47,47.5 IC6.19 | v42.42,41.58 43.61,41.58 43.69,41.66
  Bottom 0.406: IC6.20 22.46,47.75 IC6.19 | IC7.20 IC7.19
  Bottom 0.508: 24.64,81.53 22.46,79.36 IC6.20 | IC7.20 43.69,42.18 43.69,41.66 43.69,23.37 42.67,22.35 36.07,22.35 | 36.07,22.35 24.38,22.35 22.58,24.16 22.58,39.67 23.67,40.77 23.67,47.55 v23.93,47.8 22.51,47.8 22.46,47.75 | 36.07,22.35 37.59,23.88 v37.59,25.91
  Bottom 1.016: v33.15,81.53 24.64,81.53 23.37,82.8 23.37,85.85 24.38,86.87 v33.58,86.87
D0_3.3V  (via drill 0.25 pad 0.55)
  Top 0.152: IC1.51 27.02,56.9 v27.03,56.39
  Bottom 0.152: IC6.3 29.06,46.84 29.46,47.24 29.46,49.78 27.03,51.71 v27.03,56.39
D0_5V
  Top 0.254: JP2.15 20.57,53.59 22.1,52.07 22.1,47.75 U$1.R1_1
  Bottom 0.152: JP2.15 20.07,53.59 21.34,52.32 21.34,47.33 21.83,46.84 IC6.18
D1_3.3V  (via drill 0.25 pad 0.55)
  Top 0.152: IC1.53 28.02,56.52 v27.89,56.39
  Bottom 0.152: IC6.4 29.05,46.19 29.92,47.19 29.84,50.29 27.89,52.38 v27.89,56.39
D1_5V
  Top 0.254: JP2.16 20.57,51.05 21.64,49.99 21.64,46.21 21.8,46.05 22.02,46.05 U$1.R2_1
  Bottom 0.152: 20.83,50.8 20.57,51.05 JP2.16 19.61,51.05 20.95,49.71 20.95,46.61 21.34,46.23 22.42,46.23 IC6.17
D2_3.3V  (via drill 0.25 pad 0.55)
  Top 0.152: IC1.54 28.52,56.5 v28.52,55.38
  Bottom 0.152: v28.52,55.38 28.54,52.2 30.25,50.44 30.23,46.43 29.28,45.54 IC6.5
D2_5V
  Top 0.254: U$1.R3_1 22.02,45.54 21.74,45.54 20.83,46.45 20.83,48.26 20.57,48.51 JP2.17
  Bottom 0.152: IC6.16 21.01,45.54 20.62,45.92 20.62,47.27 19.38,48.51 JP2.17
D3_3.3V  (via drill 0.25 pad 0.55)
  Top 0.152: IC1.55 29.02,56.51 v29.16,56.37
  Bottom 0.152: IC6.6 29.14,44.89 30.66,46.15 30.66,50.52 29.16,52.12 v29.16,56.37
D3_5V
  Top 0.254: U$1.R4_1 19.81,44.96 JP2.18
  Bottom 0.152: IC6.15 19.88,44.89 JP2.18
D4_3.3V  (via drill 0.25 pad 0.55)
  Top 0.152: IC1.73 38.02,56.47 v38.61,55.88
  Bottom 0.152: IC7.7 39.08,46.19 40.13,46.74 40.13,49.28 38.61,50.8 v38.61,55.88
D4_5V
  Top 0.254: U$2.R5_1 46.23,44.96 JP1.18
  Bottom 0.152: IC7.14 47.03,46.19 JP1.18
D5_3.3V  (via drill 0.25 pad 0.55)
  Top 0.152: IC1.72 37.52,56.37 v37.52,55.88
  Bottom 0.152: IC7.8 38.71,46.84 39.62,47.75 39.62,49.28 37.52,51.38 v37.52,55.88
D5_5V
  Top 0.254: JP1.17 45.47,48.51 45.21,48.26 45.21,46.16 44.52,45.47 U$2.R6_1
  Bottom 0.152: IC7.13 44.8,46.84 45.21,47.24 45.21,48.26 45.47,48.51 JP1.17
D6_3.3V  (via drill 0.25 pad 0.55)
  Top 0.152: IC1.71 37.02,56.83 v36.58,56.39
  Bottom 0.152: IC7.9 38.85,47.49 39.12,47.75 39.12,48.77 37.08,50.8 | 37.08,50.8 37.02,50.29 | v36.58,56.39 36.58,51.31 37.08,50.8
D6_5V
  Top 0.254: U$2.R7_1 44.45,45.97 44.7,46.23 44.7,50.29 45.47,51.05 JP1.16
  Bottom 0.152: IC7.12 44.44,47.49 44.7,47.75 44.7,50.29 45.47,51.05 JP1.16
D7_3.3V  (via drill 0.25 pad 0.55)
  Top 0.152: IC1.70 36.52,57.34 36.27,57.08 36.25,57.08 v35.56,56.39
  Bottom 0.152: IC7.10 36.57,49.27 36.52,49.31 35.56,50.28 v35.56,56.39
D7_5V
  Top 0.254: U$2.R8_1 43.94,52.07 45.47,53.59 JP1.15
  Bottom 0.152: IC7.11 43.58,51.71 45.47,53.59 JP1.15
D+  (via drill 0.25 pad 0.55)
  Top 0.305: IC1.17 31.02,74.63 v31.19,74.8 | v28.73,84.23 J1.3
  Bottom 0.305: v31.19,74.8 34.27,77.88 34.27,81.86 33.33,82.8 29.21,82.8 28.73,82.96 v28.73,84.23
D-  (via drill 0.25 pad 0.55)
  Top 0.305: J1.2 29.61,83.81 v29.62,83.82 | IC1.18 30.52,72.18 v30.48,72.14
  Bottom 0.305: v29.62,83.82 30.1,83.34 34.54,83.31 35.05,82.8 35.05,77.22 30.48,72.64 v30.48,72.14
DIGITAL0
  Top 0.152: IC1.36 25.16,66.91 24.45,66.91 23.52,67.84 23.52,81.51 18.8,86.24 JP2.2
DIGITAL1
  Top 0.152: IC1.37 23.63,66.29 23.22,66.7 23.22,79.28 18.8,83.7 JP2.3
DIGITAL2
  Top 0.152: IC1.38 23.11,65.79 22.91,65.99 22.91,77.42 JP2.4
DIGITAL3
  Top 0.152: IC1.39 23.11,65.29 22.61,65.79 22.61,76.45 20.07,78.99 JP2.5
DIGITAL4
  Top 0.152: IC1.40 22.86,64.79 22.2,65.45 22.2,73.05 JP2.6
DIGITAL5
  Top 0.152: IC1.41 22.58,64.29 21.89,64.97 21.89,72.08 20.19,73.79 18.92,73.79 JP2.7
DIGITAL6
  Top 0.152: JP2.8 21.59,68.58 21.59,64.55 22.35,63.79 IC1.42
DIGITAL7
  Top 0.152: IC1.43 22.35,63.29 21.21,64.43 21.21,66.93 19.3,68.83 JP2.9
DIGITAL8
  Top 0.152: IC1.44 22.35,62.79 20.83,64.31 20.83,65.53 20.07,66.29 JP2.10
DIGITAL9
  Top 0.152: IC1.45 20.26,62.29 JP2.11
DIGITAL10
  Top 0.152: IC1.46 19.37,61.79 JP2.12
DIGITAL11
  Top 0.152: IC1.47 21.41,61.29 JP2.13
DIGITAL12
  Top 0.152: IC1.50 22.45,59.79 JP2.14
DIGITAL13
  Top 0.152: IC1.82 41.86,62.79 42.16,62.48 42.16,61.21 JP1.14
DIGITAL14
  Top 0.152: IC1.83 41.87,63.29 42.67,62.48 42.67,61.47 45.47,58.67 JP1.13
DIGITAL15
  Top 0.152: IC1.84 42.39,63.79 43.18,62.99 43.18,61.47 43.43,61.21 JP1.12
DIGITAL16
  Top 0.152: IC1.85 46.71,64.29 JP1.11
DIGITAL17
  Top 0.152: IC1.86 45.74,64.79 JP1.10
DIGITAL18
  Top 0.152: IC1.91 45.7,67.29 JP1.9
DIGITAL19
  Top 0.152: IC1.92 44.93,67.79 45.21,68.07 45.21,70.61 45.97,71.37 JP1.8
DIGITAL20
  Top 0.152: IC1.93 44.41,68.29 44.7,68.58 44.7,73.15 45.47,73.91 JP1.7
DIGITAL21
  Top 0.152: IC1.94 43.89,68.79 44.2,69.09 44.2,75.69 44.96,76.45 JP1.6
DIGITAL22
  Top 0.152: IC1.95 43.38,69.29 43.69,69.6 43.69,78.23 44.45,78.99 JP1.5
DIGITAL23
  Top 0.152: IC1.96 42.86,69.79 43.18,70.1 43.18,80.77 43.94,81.53 JP1.4
F0
  Top 0.152: IC3.49 23.96,36.66 20.57,33.27 JP2.23
F0_3.3V  (via drill 0.25 pad 0.55)
  Top 0.152: IC3.36 25.3,43.18 26.11,43.18 26.7,43.77 v26.85,43.77
  Bottom 0.152: v26.85,43.77 27.32,44.24 IC6.7
F0_5V
  Top 0.254: U$1.R5_1 19.81,44.45 JP2.19
  Bottom 0.152: IC6.14 19.6,44.24 JP2.19
F1
  Top 0.152: IC3.50 19.85,30.73 JP2.24
F1_3.3V  (via drill 0.25 pad 0.55)
  Top 0.152: IC3.37 26.33,42.66 v26.57,42.67
  Bottom 0.152: v26.57,42.67 27.56,43.59 IC6.8
F1_5V
  Top 0.254: U$1.R6_1 21.08,43.94 20.83,43.69 20.83,41.66 20.07,40.89 JP2.20
  Bottom 0.152: IC6.13 21.23,43.59 20.83,43.18 20.83,41.66 20.07,40.89 JP2.20
F2
  Top 0.152: IC3.52 27.52,32.6 23.11,28.19 JP2.25
F2_3.3V  (via drill 0.25 pad 0.55)
  Top 0.152: IC3.40 26.3,41.16 v26.95,41.17
  Bottom 0.152: IC6.9 27.7,42.94 26.95,42.18 v26.95,41.17
F2_5V
  Top 0.254: U$1.R7_1 22.02,43.36 21.8,43.36 21.34,42.89 21.34,39.12 20.57,38.35 JP2.21
  Bottom 0.152: IC6.12 22.27,42.74 21.63,42.74 21.34,42.45 21.34,39.12 20.57,38.35 JP2.21
F3
  Top 0.152: IC3.56 29.52,33.08 22.1,25.65 JP2.26
F3_3.3V  (via drill 0.25 pad 0.55)
  Top 0.152: IC3.41 25.31,40.64 26.42,40.64 26.92,40.13 27.61,40.13 v28.14,40.66
  Bottom 0.152: v28.14,40.66 28.34,40.86 IC6.10
F3_5V
  Top 0.254: U$1.R8_1 22.1,36.32 21.59,35.81 JP2.22
  Bottom 0.152: IC6.11 21.84,41.67 21.84,36.58 21.08,35.81 JP2.22
F4
  Top 0.152: IC3.57 30.02,33.07 20.07,23.11 JP2.27
F4_3.3V  (via drill 0.25 pad 0.55)
  Top 0.152: v38.92,42.32 39.07,42.16 IC3.88
  Bottom 0.152: IC7.3 38.34,43.59 38.67,43.26 38.67,42.57 v38.92,42.32
F4_5V
  Top 0.254: U$2.R1_1 43.94,36.45 44.58,35.81 JP1.22
  Bottom 0.152: IC7.18 44.3,43.59 44.7,43.18 44.7,36.58 45.47,35.81 JP1.22
F5
  Top 0.152: JP2.28 20.07,20.57 20.83,21.34 20.83,23.45 31.02,33.64 IC3.59
F5_3.3V  (via drill 0.25 pad 0.55)
  Top 0.152: IC3.89 39.74,42.66 v39.23,43.18
  Bottom 0.152: IC7.4 39.08,44.24 39.12,44.2 39.12,43.29 v39.23,43.18
F5_5V
  Top 0.254: U$2.R2_1 44.02,43.36 44.24,43.36 44.7,42.89 44.7,38.61 44.96,38.35 JP1.21
  Bottom 0.152: IC7.17 43.62,44.2 44.7,44.2 45.16,43.74 45.16,40.44 JP1.21
F6
  Top 0.152: JP2.29 21.34,20.57 21.34,23.37 31.52,33.55 IC3.60
F6_3.3V  (via drill 0.25 pad 0.55)
  Top 0.152: v36.28,44.4 36.28,43.98 37.08,43.18 38.44,43.18 38.99,43.74 39.46,43.74 40.01,43.18 40.74,43.18 IC3.90
  Bottom 0.152: IC7.5 36.77,44.89 v36.28,44.4
F6_5V
  Top 0.254: U$2.R3_1 44.96,43.94 45.21,43.69 45.21,41.66 45.97,40.89 JP1.20
  Bottom 0.152: IC7.16 45.03,44.89 45.47,44.45 45.47,42.16 46.74,40.89 JP1.20
F7
  Top 0.152: IC3.61 31.9,34.3 31.9,33.5 21.84,23.45 21.84,18.54 JP2.30
F7_3.3V  (via drill 0.25 pad 0.55)
  Top 0.152: IC3.93 40.72,44.7 39.88,44.7 39.52,45.01 v39.52,45.52
  Bottom 0.152: IC7.6 39.5,45.54 v39.52,45.52
F7_5V
  Top 0.254: U$2.R4_1 46.23,44.45 JP1.19
  Bottom 0.152: IC7.15 45.14,45.54 JP1.19
F8
  Top 0.152: IC3.64 33.52,33.03 34.54,32 36.58,32 44.2,24.38 44.2,18.29 46.99,15.49 JP1.30
F9
  Top 0.152: IC3.65 34.02,33.04 34.7,32.31 36.73,32.31 44.7,24.38 44.7,20.57 JP1.29
F10
  Top 0.152: IC3.70 36.58,34.37 36.58,33.02 39.12,30.48 45.21,24.38 45.21,21.34 45.97,20.57 JP1.28
F11
  Top 0.152: IC3.71 37.02,33.08 46.99,23.11 JP1.27
F12
  Top 0.152: IC3.72 37.52,33.09 44.96,25.65 JP1.26
F13
  Top 0.152: IC3.73 38.02,33.1 42.93,28.19 JP1.25
F14
  Top 0.152: IC3.77 42.58,36.66 45.21,34.04 45.21,31.5 45.97,30.73 JP1.24
F15
  Top 0.152: IC3.78 42.59,37.16 46.48,33.27 JP1.23
GND  (via drill 0.25 pad 0.55)
  Top 0.152: 36.07,34.38 IC3.69
  Top 0.254: IC3.42 24.42,40.16 24.27,40.01 24.27,37.9 24.5,37.66 IC3.47 29.9,37.66 | IC3.58 30.52,37.04 29.9,37.66 | IC3.63 33.02,37.08 32.44,37.66 | 29.9,37.66 32.44,37.66 | IC3.69 36.02,37.13 35.49,37.66 | 32.44,37.66 35.49,37.66 | 35.49,37.66 38.03,37.66 | IC3.74 38.52,37.17 38.03,37.66 | 38.03,37.66 38.53,38.16 | 38.53,38.16 IC3.80 | 38.53,38.16 v38.53,41.07 | v38.53,41.07 39.12,41.66 IC3.87 40.83,41.73 41.61,41.73 41.86,41.98 41.86,43.34 | 41.86,43.34 41.54,43.66 IC3.91 | 41.86,43.34 41.86,45.44 41.64,45.66 IC3.95 | IC3.8 35.52,48.73 34.82,48.03 | 27.23,48.26 v27.05,48.36 30.03,48.36 30.52,48.73 IC3.18 30.52,50.84 30.99,51.31 32,51.31 32.52,50.79 IC3.14 32.52,48.76 33.25,48.03 34.82,48.03 | IC1.5 37.02,74.15 37.04,74.17 | IC1.16 | IC1.49 25.28,60.28 | 34.82,48.03 34.82,44.77 v38.53,41.07
  Top 0.305: v27.51,61.9 v27.51,67.06 26.37,67.06 26.16,67.27 25.3,67.27 IC1.35 | v27.48,60.12 30.3,60.12 31.52,58.9 IC1.60 | 37.04,73.72 37.04,74.17 37.04,74.63 40.07,77.66 | v30.99,69.09 31.51,69.61 IC1.16 | 27.02,78.7 27.02,77.82 26.92,77.72 27.02,77.63 IC1.25 27.02,69.22 v27.52,68.72 | v38.1,59.94 38.52,59.52 IC1.74 38.52,56.98 38.61,56.9 39.52,56.9 39.62,57 | 39.62,57 39.62,65.53 39.88,65.79 IC1.88 | IC1.98 41.83,70.79 42.16,71.12 v42.16,78.23 | IC3.8 35.52,53.81 36.07,54.36 39.12,54.36 39.62,54.86 39.62,57 | v35.59,29.36 35.12,29.02 C3.2
  Top 0.356: v27.52,68.72 v27.51,68.71 | v27.48,60.12 27.33,60.28 25.28,60.28 | C1.1 40.07,77.66
  Top 0.406: C3.2 33.02,25.33 | C4.2 33.02,25.33 | 33.02,25.33 PS1.2 PS1.4
  Top 0.457: JP2.1 23.41,84.54 27.4,84.54 27.62,84.77 27.62,85.58 J1.5 27.66,81.28 27.66,79.33 IC2.4 27.02,78.7 | JP1.1 45.47,89.15 44.7,88.39 44.7,84.33 43.18,82.8 40.07,82.8
  Top 0.508: C1.1 v42.16,78.23
  Top 0.914: C1.1 C2.2
  Top 1.016: C2.2 40.07,82.3 | 40.07,82.3 40.07,82.8 IC4.1 | 40.07,82.3 39.56,82.8 28.45,82.8 27.66,82.01 27.66,81.28
  Bottom 0.254: IC7.1 38.53,41.46 v38.53,41.07 | IC6.1 27.35,48.14 v27.05,48.36
  Bottom 0.305: v27.51,67.06 v27.51,68.71 30.61,68.71 v30.99,69.09
  Bottom 0.356: v27.48,60.12 27.51,60.15 v27.51,61.9 27.58,61.98 36.58,61.98 38.1,60.45 v38.1,59.94
  Bottom 0.508: v35.59,29.36 35.6,29.5 J2.6 35.6,31.5 36.07,31.96 36.07,32 40.64,32 41.15,32.51 41.15,50.29 43.69,52.83 43.69,77.22 42.67,78.23 v42.16,78.23
  pour Top (no thermals): 26.87,74.27 26.87,72.77 27.66,72.77 27.66,74.27
N$30
  Bottom 0.457: F1.2 45.93,87.93 JP1.2
SD_CARD_MISO  (via drill 0.25 pad 0.55)
  Top 0.152: v25.4,33.02 25.4,33.31 IC3.51 | IC1.62 32.52,59.34 v33.12,59.44
  Bottom 0.152: J2.7 36.7,29.08 35.99,28.25 26.85,28.25 25.4,29.97 v25.4,33.02 25.4,58.42 26.42,59.44 v33.12,59.44
SD_CARD_MOSI  (via drill 0.25 pad 0.55)
  Top 0.152: IC1.63 v33.02,56.39
  Bottom 0.152: v33.02,56.39 32.3,55.16 32.3,32.51 J2.3
SD_CARD_PCS0  (via drill 0.25 pad 0.55)
  Top 0.152: IC1.58 30.48,58.01 v30.48,56.39
  Bottom 0.152: J2.2 31.2,31.29 30.48,32 30.48,33.02 31.24,33.78 31.24,50.52 30.48,51.28 v30.48,56.39
SD_CARD_SCLK  (via drill 0.25 pad 0.55)
  Top 0.152: 27.99,34.4 IC3.53 28.02,33.19 v28.19,33.02 | v31.75,28.96 31.72,28.99 31.72,31.9 v31.49,32.13 | v31.11,55.37 31.11,57.95 IC1.59
  Bottom 0.152: 34.54,30.58 J2.5 34.5,29.42 34.04,28.96 v31.75,28.96 27.43,28.96 26.92,29.46 26.92,32.51 27.43,33.02 v28.19,33.02 | v31.11,55.37 31.11,51.77 31.75,51.13 31.75,32.39 v31.49,32.13
VIN  (via drill 0.25 pad 0.55)
  Top 0.457: IC4.5 IC4.4 42.29,88.27 42.67,87.88 v42.67,85.85 42.55,85.72 IC4.2
  Bottom 0.457: F1.1 v42.67,85.85
VUSB  (via drill 0.25 pad 0.55)
  Top 0.457: J1.1 30.26,84.55 v30.48,84.33 | v38.1,86.36 38.73,87 IC4.3
  Bottom 0.457: v30.48,84.33 37.59,84.33 38.1,84.84 v38.1,86.36